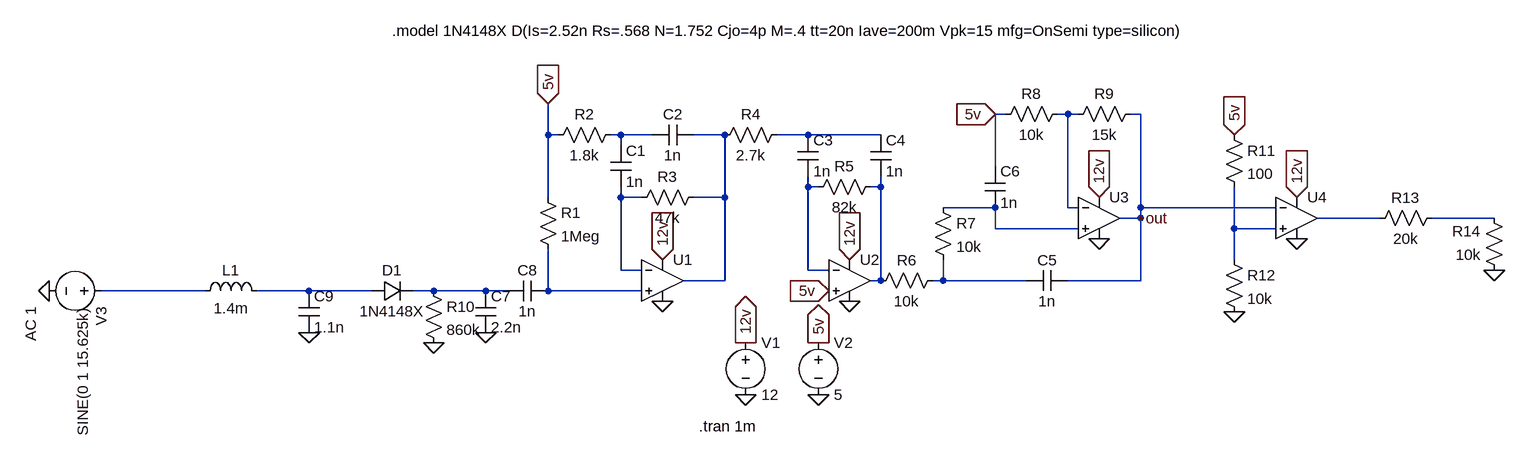
[diagram p0: schematic demodulation.asc]
demodulation.asc, the LTspice schematic file:
Version 4
SHEET 1 1684 680
WIRE 912 -128 896 -128
WIRE 1008 -128 992 -128
WIRE 1024 -128 1008 -128
WIRE 1120 -128 1104 -128
WIRE 208 -96 208 -144
WIRE 224 -96 208 -96
WIRE 320 -96 304 -96
WIRE 368 -96 320 -96
WIRE 480 -96 432 -96
WIRE 608 -96 560 -96
WIRE 720 -96 608 -96
WIRE 320 -80 320 -96
WIRE 896 -48 896 -128
WIRE 608 -16 608 -32
WIRE 624 -16 608 -16
WIRE 720 -16 720 -32
WIRE 720 -16 704 -16
WIRE 208 0 208 -96
WIRE 320 0 320 -16
WIRE 352 0 320 0
WIRE 480 0 480 -96
WIRE 480 0 432 0
WIRE 896 16 816 16
WIRE 1008 16 1008 -128
WIRE 1024 16 1008 16
WIRE 1120 16 1120 -128
WIRE 1328 16 1120 16
WIRE 1120 32 1120 16
WIRE 1120 32 1088 32
WIRE 1488 32 1392 32
WIRE 1664 32 1568 32
WIRE 896 48 896 16
WIRE 1024 48 896 48
WIRE 1264 48 1264 -16
WIRE 1328 48 1264 48
WIRE 1264 96 1264 48
WIRE 320 112 320 0
WIRE 352 112 320 112
WIRE 608 112 608 -16
WIRE 640 112 608 112
WIRE 480 128 480 0
WIRE 480 128 416 128
WIRE 720 128 720 -16
WIRE 720 128 704 128
WIRE 816 128 816 96
WIRE 816 128 800 128
WIRE 944 128 816 128
WIRE 1120 128 1120 32
WIRE 1120 128 1008 128
WIRE -320 144 -480 144
WIRE -160 144 -240 144
WIRE -64 144 -160 144
WIRE 32 144 0 144
WIRE 112 144 32 144
WIRE 144 144 112 144
WIRE 208 144 208 80
WIRE 352 144 208 144
FLAG 624 304 0
FLAG 512 304 0
FLAG -560 144 0
FLAG 512 224 12v
IOPIN 512 224 Out
FLAG 624 224 5v
IOPIN 624 224 Out
FLAG 384 160 0
FLAG 672 160 0
FLAG 1056 64 0
FLAG 208 -144 5v
IOPIN 208 -144 In
FLAG 384 96 12v
IOPIN 384 96 In
FLAG 672 96 12v
IOPIN 672 96 In
FLAG 640 144 5v
IOPIN 640 144 In
FLAG 1056 0 12v
IOPIN 1056 0 In
FLAG 1120 32 out
FLAG 896 -128 5v
IOPIN 896 -128 In
FLAG 112 208 0
FLAG 32 224 0
FLAG 1264 -96 5v
IOPIN 1264 -96 In
FLAG 1264 176 0
FLAG 1360 64 0
FLAG 1664 112 0
FLAG -160 208 0
FLAG 1360 0 12v
IOPIN 1360 0 In
SYMBOL voltage 512 208 R0
SYMATTR InstName V1
SYMATTR Value 12
SYMBOL voltage 624 208 R0
SYMATTR InstName V2
SYMATTR Value 5
SYMBOL voltage -464 144 R90
WINDOW 123 24 124 Left 2
WINDOW 39 0 0 Left 2
WINDOW 3 24 44 Left 2
SYMATTR Value2 AC 1
SYMATTR Value SINE(0 1 15.625k)
SYMATTR InstName V3
SYMBOL Opamps\\UniversalOpamp2 384 128 R0
SYMATTR InstName U1
SYMBOL Opamps\\UniversalOpamp2 672 128 R0
SYMATTR InstName U2
SYMBOL Opamps\\UniversalOpamp2 1056 32 R0
SYMATTR InstName U3
SYMBOL res 192 -16 R0
SYMATTR InstName R1
SYMATTR Value 1Meg
SYMBOL res 320 -112 R90
WINDOW 0 0 56 VBottom 2
WINDOW 3 32 56 VTop 2
SYMATTR InstName R2
SYMATTR Value 1.8k
SYMBOL res 448 -16 R90
WINDOW 0 0 56 VBottom 2
WINDOW 3 32 56 VTop 2
SYMATTR InstName R3
SYMATTR Value 47k
SYMBOL cap 304 -80 R0
SYMATTR InstName C1
SYMATTR Value 1n
SYMBOL cap 432 -112 R90
WINDOW 0 0 32 VBottom 2
WINDOW 3 32 32 VTop 2
SYMATTR InstName C2
SYMATTR Value 1n
SYMBOL res 576 -112 R90
WINDOW 0 0 56 VBottom 2
WINDOW 3 32 56 VTop 2
SYMATTR InstName R4
SYMATTR Value 2.7k
SYMBOL cap 592 -96 R0
SYMATTR InstName C3
SYMATTR Value 1n
SYMBOL cap 704 -96 R0
SYMATTR InstName C4
SYMATTR Value 1n
SYMBOL res 720 -32 R90
WINDOW 0 0 56 VBottom 2
WINDOW 3 32 56 VTop 2
SYMATTR InstName R5
SYMATTR Value 82k
SYMBOL res 816 112 R90
WINDOW 0 0 56 VBottom 2
WINDOW 3 32 56 VTop 2
SYMATTR InstName R6
SYMATTR Value 10k
SYMBOL cap 1008 112 R90
WINDOW 0 0 32 VBottom 2
WINDOW 3 32 32 VTop 2
SYMATTR InstName C5
SYMATTR Value 1n
SYMBOL res 800 0 R0
SYMATTR InstName R7
SYMATTR Value 10k
SYMBOL cap 880 -48 R0
SYMATTR InstName C6
SYMATTR Value 1n
SYMBOL res 1008 -144 R90
WINDOW 0 0 56 VBottom 2
WINDOW 3 32 56 VTop 2
SYMATTR InstName R8
SYMATTR Value 10k
SYMBOL res 1120 -144 R90
WINDOW 0 0 56 VBottom 2
WINDOW 3 32 56 VTop 2
SYMATTR InstName R9
SYMATTR Value 15k
SYMBOL diode -64 160 R270
WINDOW 0 32 32 VTop 2
WINDOW 3 0 32 VBottom 2
SYMATTR InstName D1
SYMATTR Value 1N4148X
SYMBOL res 16 128 R0
SYMATTR InstName R10
SYMATTR Value 860k
SYMBOL cap 96 144 R0
SYMATTR InstName C7
SYMATTR Value 2.2n
SYMBOL Opamps\\UniversalOpamp2 1360 32 R0
SYMATTR InstName U4
SYMBOL res 1248 -112 R0
SYMATTR InstName R11
SYMATTR Value 100
SYMBOL res 1248 80 R0
SYMATTR InstName R12
SYMATTR Value 10k
SYMBOL res 1584 16 R90
WINDOW 0 0 56 VBottom 2
WINDOW 3 32 56 VTop 2
SYMATTR InstName R13
SYMATTR Value 20k
SYMBOL res 1680 128 R180
WINDOW 0 36 76 Left 2
WINDOW 3 36 40 Left 2
SYMATTR InstName R14
SYMATTR Value 10k
SYMBOL cap 208 128 R90
WINDOW 0 0 32 VBottom 2
WINDOW 3 32 32 VTop 2
SYMATTR InstName C8
SYMATTR Value 1n
SYMBOL ind -336 160 R270
WINDOW 0 32 56 VTop 2
WINDOW 3 5 56 VBottom 2
SYMATTR InstName L1
SYMATTR Value 1.4m
SYMBOL cap -176 144 R0
SYMATTR InstName C9
SYMATTR Value 1.1n
TEXT 440 352 Left 2 !.tran 1m
TEXT -32 -256 Left 2 !.model 1N4148X D(Is=2.52n Rs=.568 N=1.752 Cjo=4p M=.4 tt=20n Iave=200m Vpk=15 mfg=OnSemi type=silicon)

The netlist it stands for:
* demodulation.asc
V1 12v 0 12
V2 5v 0 5
V3 N013 0 SINE(0 1 15.625k) AC 1
XU1 N016 N007 12v 0 N003 level.2 Avol=1Meg GBW=10Meg Slew=10Meg ilimit=25m rail=0 Vos=0 phimargin=45 en=0 enk=0 in=0 ink=0 Rin=500Meg  ; pins IN+ IN- V+ V- OUT
XU2 5v N005 12v 0 N006 level.2 Avol=1Meg GBW=10Meg Slew=10Meg ilimit=25m rail=0 Vos=0 phimargin=45 en=0 enk=0 in=0 ink=0 Rin=500Meg  ; pins IN+ IN- V+ V- OUT
XU3 N008 N001 12v 0 out level.2 Avol=1Meg GBW=10Meg Slew=10Meg ilimit=25m rail=0 Vos=0 phimargin=45 en=0 enk=0 in=0 ink=0 Rin=500Meg  ; pins IN+ IN- V+ V- OUT
R1 5v N016 1Meg
R2 N002 5v 1.8k
R3 N003 N007 47k
C1 N002 N007 1n
C2 N003 N002 1n
R4 N004 N003 2.7k
C3 N004 N005 1n
C4 N004 N006 1n
R5 N006 N005 82k
R6 N012 N006 10k
C5 out N012 1n
R7 N008 N012 10k
C6 5v N008 1n
R8 N001 5v 10k
R9 out N001 15k
D1 N014 N015 1N4148X
R10 N015 0 860k
C7 N015 0 2.2n
XU4 N011 out 12v 0 N009 level.2 Avol=1Meg GBW=10Meg Slew=10Meg ilimit=25m rail=0 Vos=0 phimargin=45 en=0 enk=0 in=0 ink=0 Rin=500Meg  ; pins IN+ IN- V+ V- OUT
R11 5v N011 100
R12 N011 0 10k
R13 N010 N009 20k
R14 0 N010 10k
C8 N016 N015 1n
L1 N013 N014 1.4m
C9 N014 0 1.1n
.model D D
.lib standard.dio
.tran 1m
.model 1N4148X D(Is=2.52n Rs=.568 N=1.752 Cjo=4p M=.4 tt=20n Iave=200m Vpk=15 mfg=OnSemi type=silicon)
.lib UniversalOpamps2.sub
.backanno
.end